# EAGLE design OSSIBeaconPA (EAGLE 6.1)
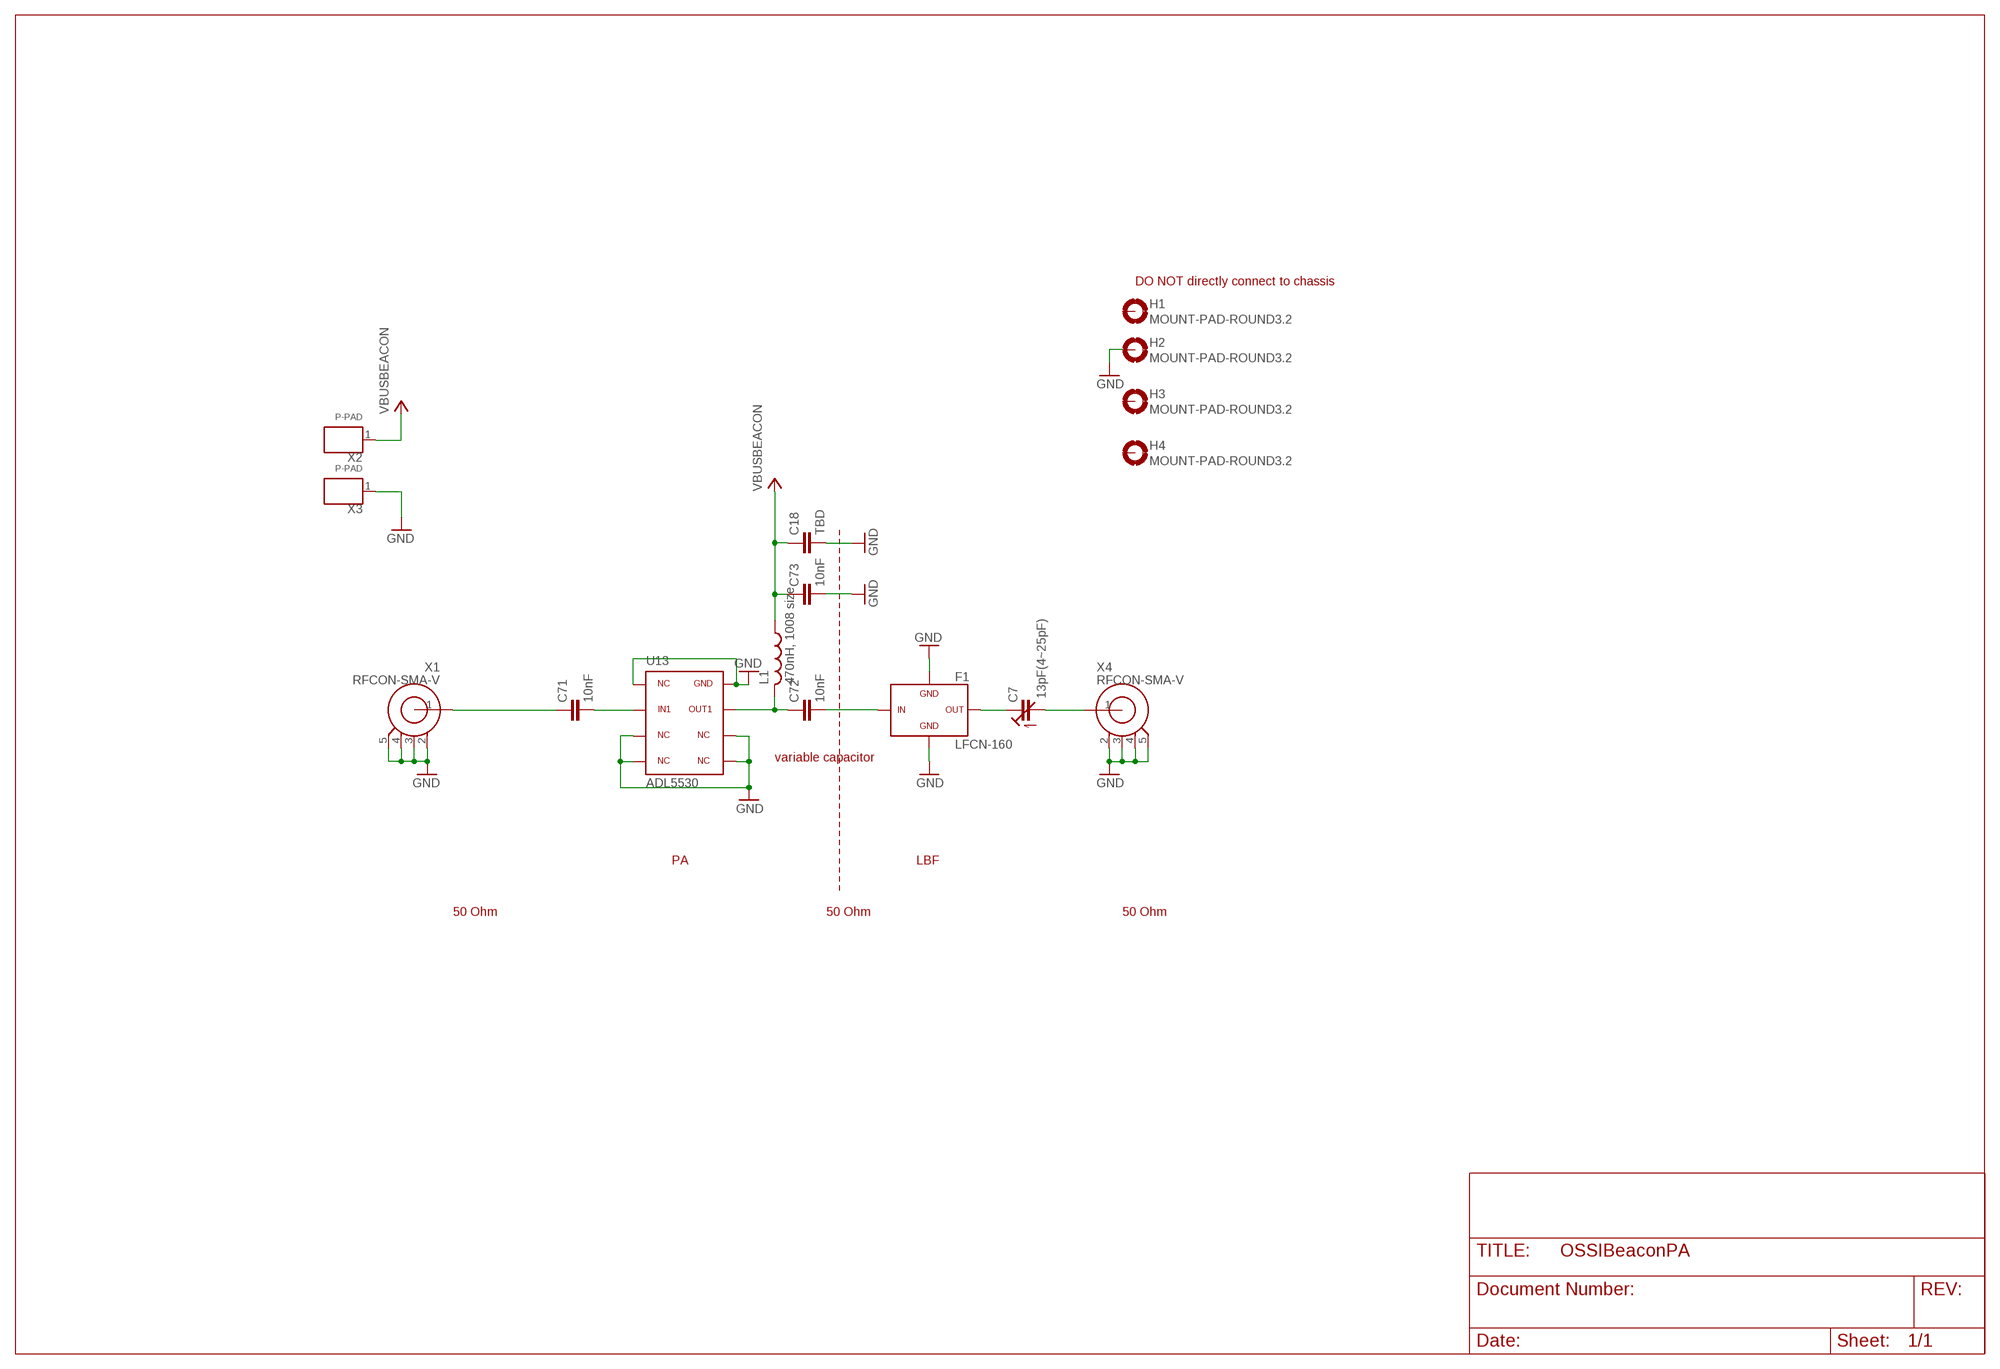
[diagram p0: schematic, sheet 1]

## Parts
C7  13pF(4~25pF)  C-TRIMM  [TZB4Z250BA10R00]
C18  TBD  C0603(1608)  [C0603(1608)]
C71  10nF  C0603(1608)  [C0603(1608)]
C72  10nF  C0603(1608)  [C0603(1608)]
C73  10nF  C0603(1608)  [C0603(1608)]
F1  LFCN-160  [LFCN]
H1  MOUNT-PAD-ROUND3.2  [3.2-PAD-ROUND]
H2  MOUNT-PAD-ROUND3.2  [3.2-PAD-ROUND]
H3  MOUNT-PAD-ROUND3.2  [3.2-PAD-ROUND]
H4  MOUNT-PAD-ROUND3.2  [3.2-PAD-ROUND]
L1  470nH, 1008 size  L1008(2502)  [L1008(2520)]
U13  ADL5530  [LFCSP8_CP]
X1  RFCON-SMA-V  [SMA-V]
X2  P-PAD  [P-PAD]
X3  P-PAD  [P-PAD]
X4  RFCON-SMA-V  [SMA-V]

## Nets
GND: C18.2 C73.2 F1.2 F1.4 H2.B3,2(MOUNT) U13.1 U13.3 U13.4 U13.5 U13.6 U13.8 X1.2 X1.3 X1.4 X1.5 X3.1 X4.2 X4.3 X4.4 X4.5
N$1: C71.1 X1.1
N$2: C7.+(E) F1.3
N$3: C7.-(A) X4.1
N$39: C72.2 F1.1
N$41: C72.1 L1.P$2 U13.7
N$56: C71.2 U13.2
VBUSBEACON: C18.1 C73.1 L1.P$1 X2.1
Unconnected: H1.B3,2(MOUNT) H3.B3,2(MOUNT) H4.B3,2(MOUNT)

## Notes on the sheet
- DO NOT directly connect to chassis
- variable capacitor
- PA | LBF
- 50 Ohm | 50 Ohm | 50 Ohm

## Library data of the parts
C7 = OSSI:C-TRIMM
C18 C71-C73 = OSSI:C
F1 = OSSI:LFCN-160: LFCN-160 Low Pass Filter DC - 160MHz Low Pass Filter Cut Off Freq: 230MHz 8W power rating ( degraded to 3W at 100 celcius degree)
H1-H4 = OSSI:MOUNT-PAD-ROUND
L1 = OSSI:L
U13 = OSSI:ADL5530: ADL5530 IF Gain Block Fixed gain: 16.dB Operation: 0~1000Mhz Internally matched input and output to 50 Ω Power supply: 3V or 5V 110 mA power supply current
X1 X4 = OSSI:RFCON: RF Connectors
X2 X3 = OSSI:P-PAD

## Board
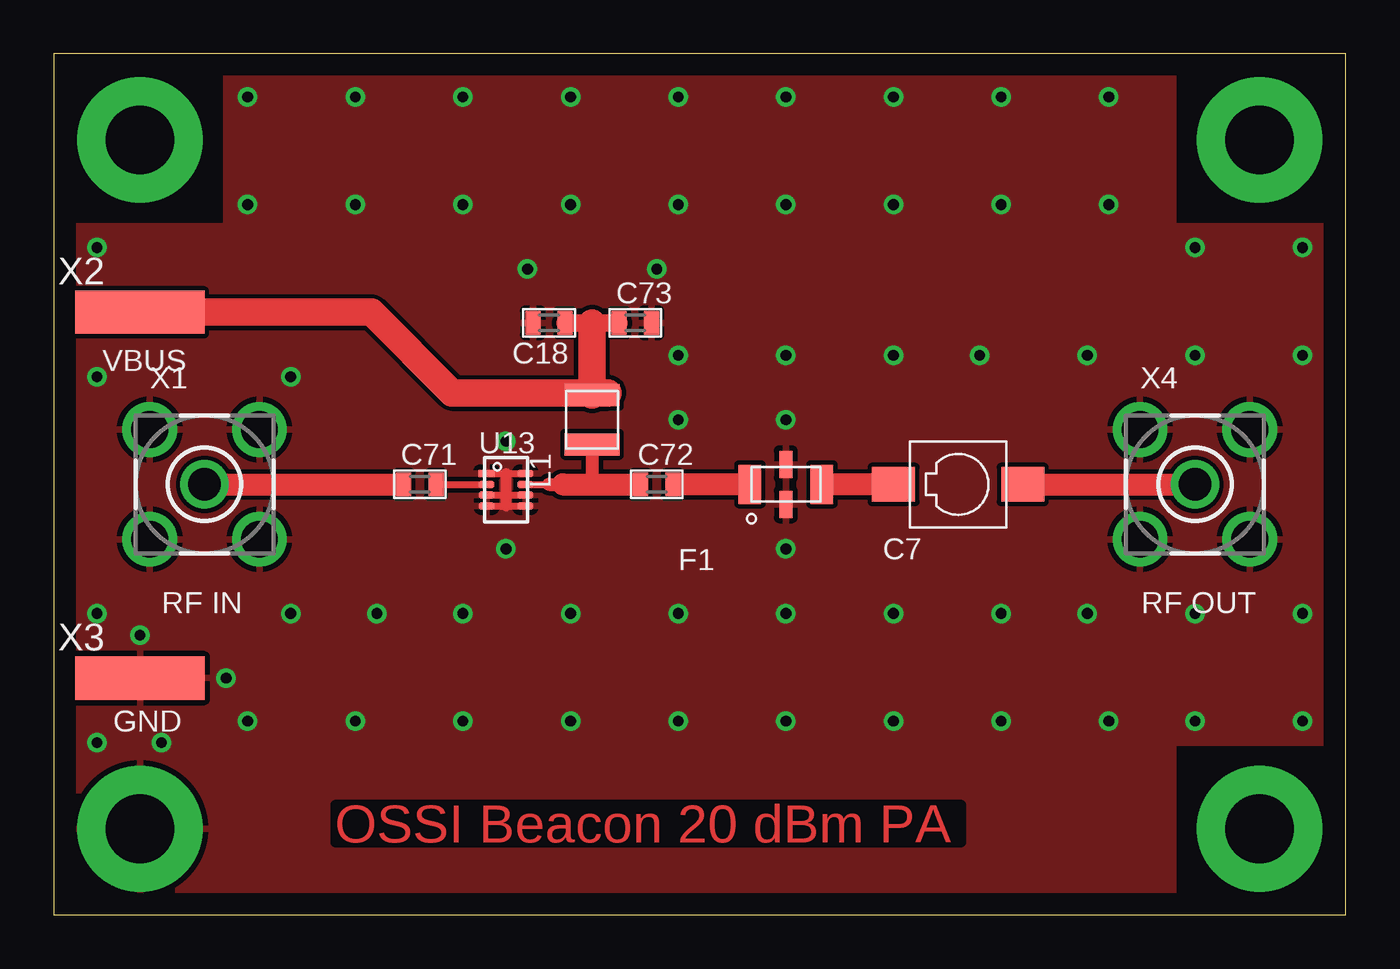
[diagram p1: board, top side]
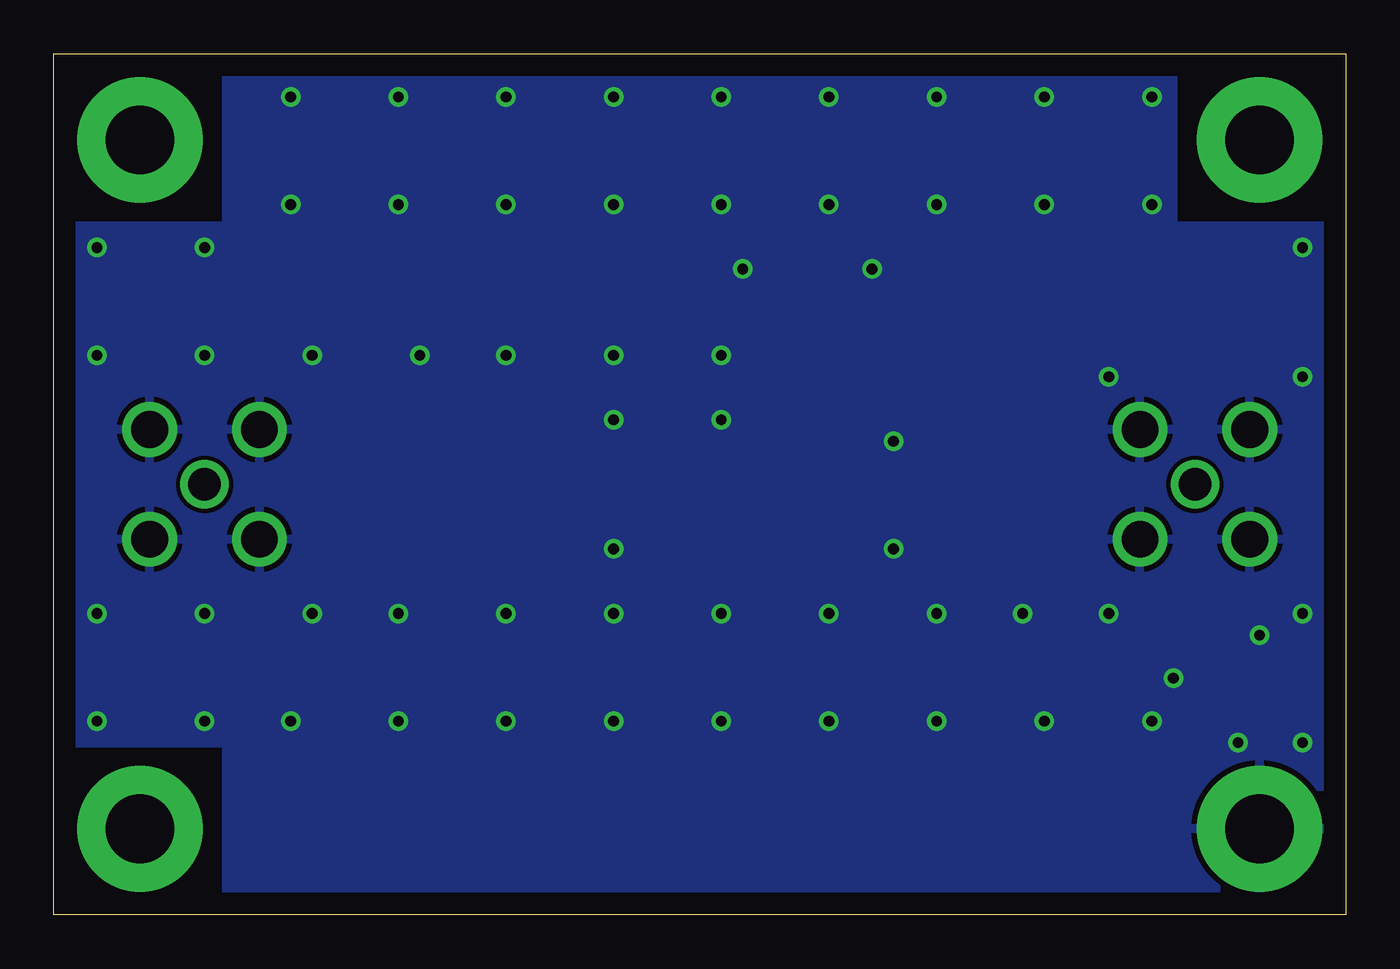
[diagram p2: board, bottom side, seen from below]

Size 60 x 40 mm. Coordinates in mm from the lower left corner, seen from the top.
Outline: 0,0 60,0 60,40 0,40 0,0
Copper layers (1*16): Top 0.035mm / dielectric 1.5mm / Bottom 0.035mm
Design rules: minimum track width 10mil, minimum drill 24mil, track to track 8mil, track to pad 8mil, pad to pad 8mil, via to via 8mil, smd to smd 8mil, copper to edge 40mil, drill to drill 8mil, minimum pad ring 10mil, minimum via ring 8mil, stop-mask expansion 4mil, vias tented up to drill 0mil, thermal gap 10mil

### Footprints (pad centres in the part's own frame; a part is rotated, then mirrored left to right if it is on the bottom)
TZB4Z250BA10R00 = smd 2 x 1.6: + -3,0; - 3,0
C0603(1608) = smd 0.7 x 1.1: 1 -0.75,0; 2 0.75,0
LFCN = smd 1.045 x 1.8: 1 -1.675,0; 3 1.675,0 | smd 0.61 x 1.25: 2 0,-0.925; 4 0,0.925
3.2-PAD-ROUND = drill 3.2 pad 5.842: B3,2 0,0
L1008(2520) = smd 2.54 x 1.02: P$1 0,1.145; P$2 0,-1.145
LFCSP8_CP = smd 0.73 x 0.33: 1 -0.9,0.75; 2 -0.9,0.25; 3 -0.9,-0.25; 4 -0.9,-0.75; 5 0.9,-0.75; 6 0.9,-0.25; 7 0.9,0.25; 8 0.9,0.75
SMA-V = drill 1.5: 1 0,0 | drill 1.7: 2 -2.55,2.55; 3 2.55,2.55; 4 2.55,-2.55; 5 -2.55,-2.55
P-PAD = smd 6 x 2: 1 0,0

### Placement (x,y rotation side)
C7  42,20 0 top
C18  23,27.5 180 top
C71  17,20 0 top
C72  28,20 0 top
C73  27,27.5 0 top
F1  34,20 0 top
H1  4,36 0 top
H2  4,4 0 top
H3  56,4 0 top
H4  56,36 0 top
L1  25,23 0 top
U13  21,19.75 0 top
X1  7,20 0 top
X2  4,28 0 top
X3  4,11 0 top
X4  53,20 0 top

### Tracks (layer width: path | path; a pad name or v marks a point on that pad's centre or on a via)
GND  (via drill 0.5)
  Top 0.33: U13.5 U13.4 21,19 | U13.3 U13.6 | U13.1 21,20.5 U13.8
  Top 0.48: 21,19 21,20.5
  other vias: 9,38 14,38 19,38 24,38 29,38 34,38 39,38 44,38 49,38 9,33 14,33 19,33 24,33 29,33 34,33 39,33 44,33 49,33 53,31 58,31 2,31 58,26 53,26 48,26 43,26 34,23 34,17 28,30 22,30 2,14 2,25 2,8 9,9 14,9 19,9 24,9 29,9 34,9 39,9 44,9 49,9 58,9 58,14 53,14 53,9 48,14 11,25 11,14 21,22 19,14 24,14 29,14 34,14 39,14 44,14 39,26 34,26 29,26 29,23 15,14 21,17 8,11 5,8 4,13
  pour Bottom: 8,40 52,40 52,32 60,32 60,8 52,8 52,0 0,0 0,32 8,32
  pour Top: 0,32 8,32 8,40 52,40 52,32 60,32 60,8 52,8 52,0 0,0 0,29
N$1
  Top 0.254: C71.1 16,20
  Top 1.016: X1.1 16,20
N$2
  Top 1.016: C7.+ F1.3
N$3
  Top 1.016: C7.- X4.1
N$39
  Top 0.254: C72.2 29,20
  Top 1.016: F1.1 29,20
N$41
  Top 0.254: C72.1 27,20
  Top 0.33: U13.7 23,20
  Top 0.61: 23,20 23.64,20 | L1.P$2 25,20
  Top 1.016: 23.64,20 25,20 27,20
N$56
  Top 0.33: C71.2 U13.2
VBUSBEACON
  Top 0.254: L1.P$1 25.15,24.13 25.15,24.25
  Top 0.813: C18.1 25,27.5 C73.1
  Top 1.27: X2.1 14.75,28 18.5,24.25 25.15,24.25 25.75,24.25 | L1.P$1 25,27.5

### Text on the board
Top: OSSI Beacon 20 dBm PA
tPlace: VBUS | RF IN | RF OUT | GND
tStop: OSSI Beacon 20 dBm PA